# Altium project NANORACK_LASER_EXT.PrjPcb
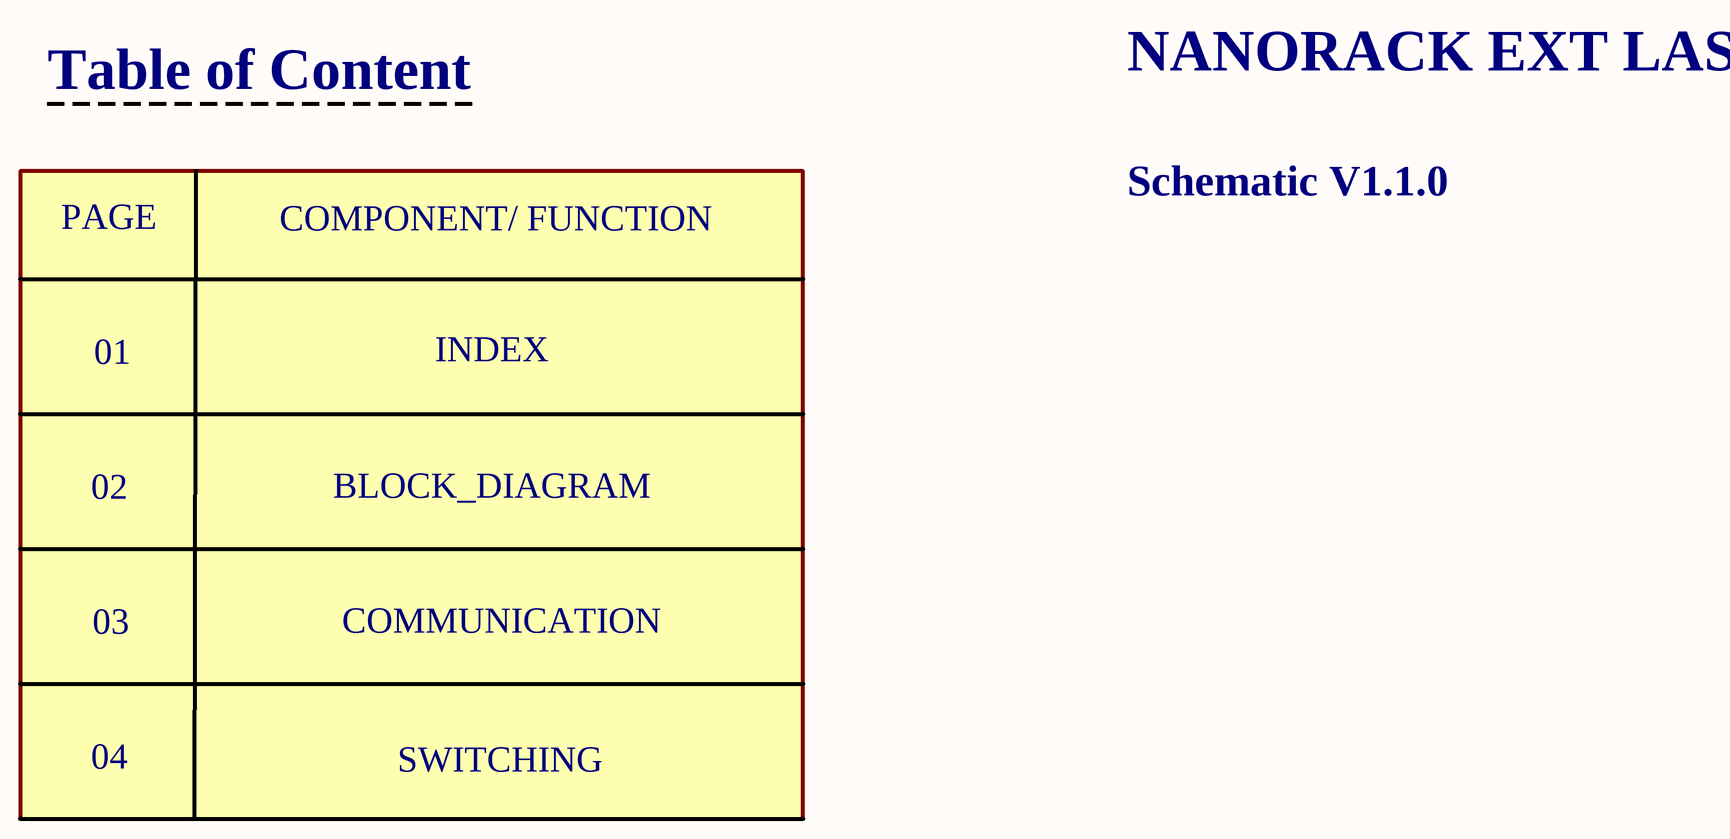
[diagram p0: INDEX.SchDoc]
4 sheets, 39 parts. Net scope: global (net labels, ports and power ports of the same name join across sheets).
Board file: LASER_EXT_V1.1.0.PcbDoc
Sheets:
  INDEX.SchDoc
  BLOCK_DIAGRAM.SchDoc
  COMMUNICATION.SchDoc
  SWITCHING.SchDoc

## Sheet INDEX.SchDoc
size 420 x 297 mm; Date: 21/02/2025; Address1: BEE-PC1; SheetNumber: 1; SheetTotal: 4

### Notes on the sheet
- NANORACK EXT LASER
- Table of Content
- COMPONENT/ FUNCTION
- Schematic V1.1.0
- PAGE
- INDEX
- 01
- BLOCK_DIAGRAM
- 02
- COMMUNICATION
- 03
- SWITCHING
- 04
- Project:
- Sub-system:
- Design by:
- SAMY VE
- BAO BUI Q.
- Sheet title:
- Sheet
- A3
- of
- Checked by:
- Approved by:
- VU PHAM
- Revision:
- Document No:
- V1.1.0
- Size:
- Date:

## Sheet BLOCK_DIAGRAM.SchDoc
size 420 x 297 mm; Date: 21/02/2025; Address1: BEE-PC1; SheetNumber: 2; SheetTotal: 4
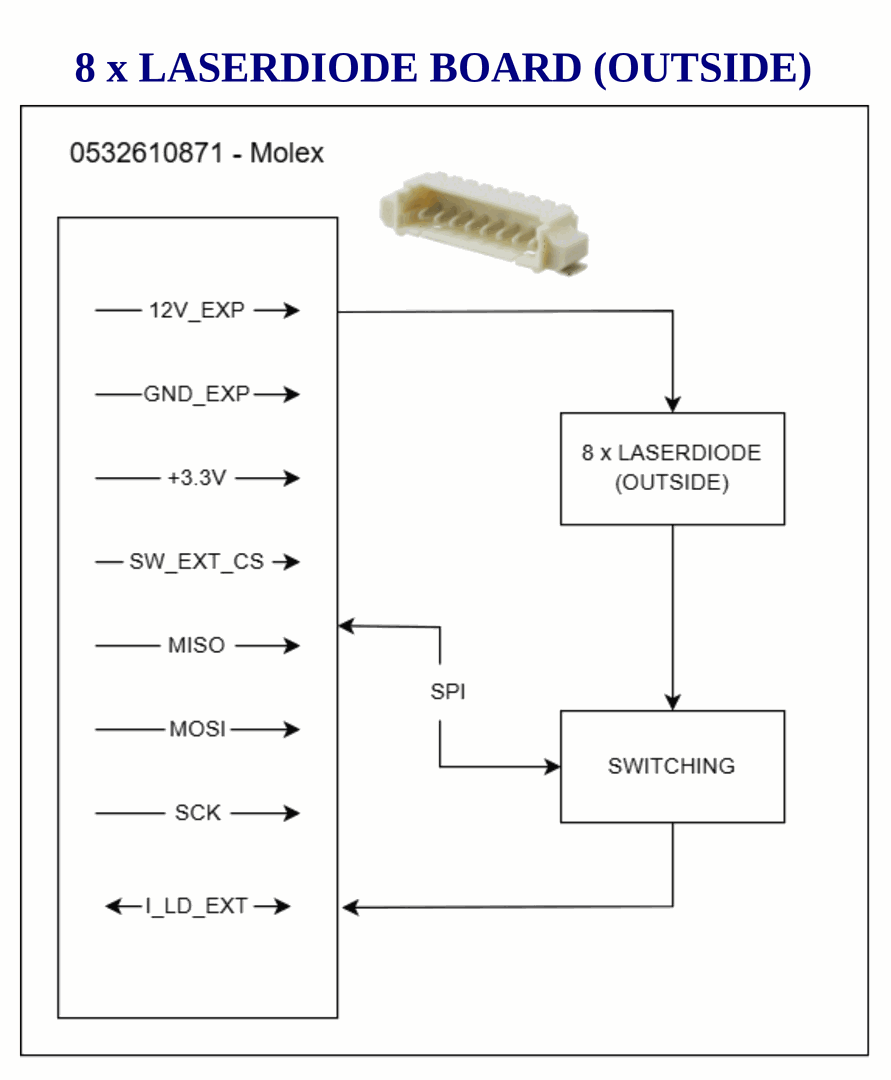
[diagram p1: BLOCK_DIAGRAM.SchDoc]

### Notes on the sheet
- 8 x LASERDIODE BOARD (OUTSIDE)
- Project:
- Sub-system:
- Design by:
- SAMY VE
- BAO BUI Q.
- Sheet title:
- Sheet
- A3
- of
- Checked by:
- Approved by:
- VU PHAM
- Revision:
- Document No:
- V1.1.0
- Size:
- Date:

## Sheet COMMUNICATION.SchDoc
size 420 x 297 mm; Date: 21/02/2025; Address1: BEE-PC1; SheetNumber: 3; SheetTotal: 4
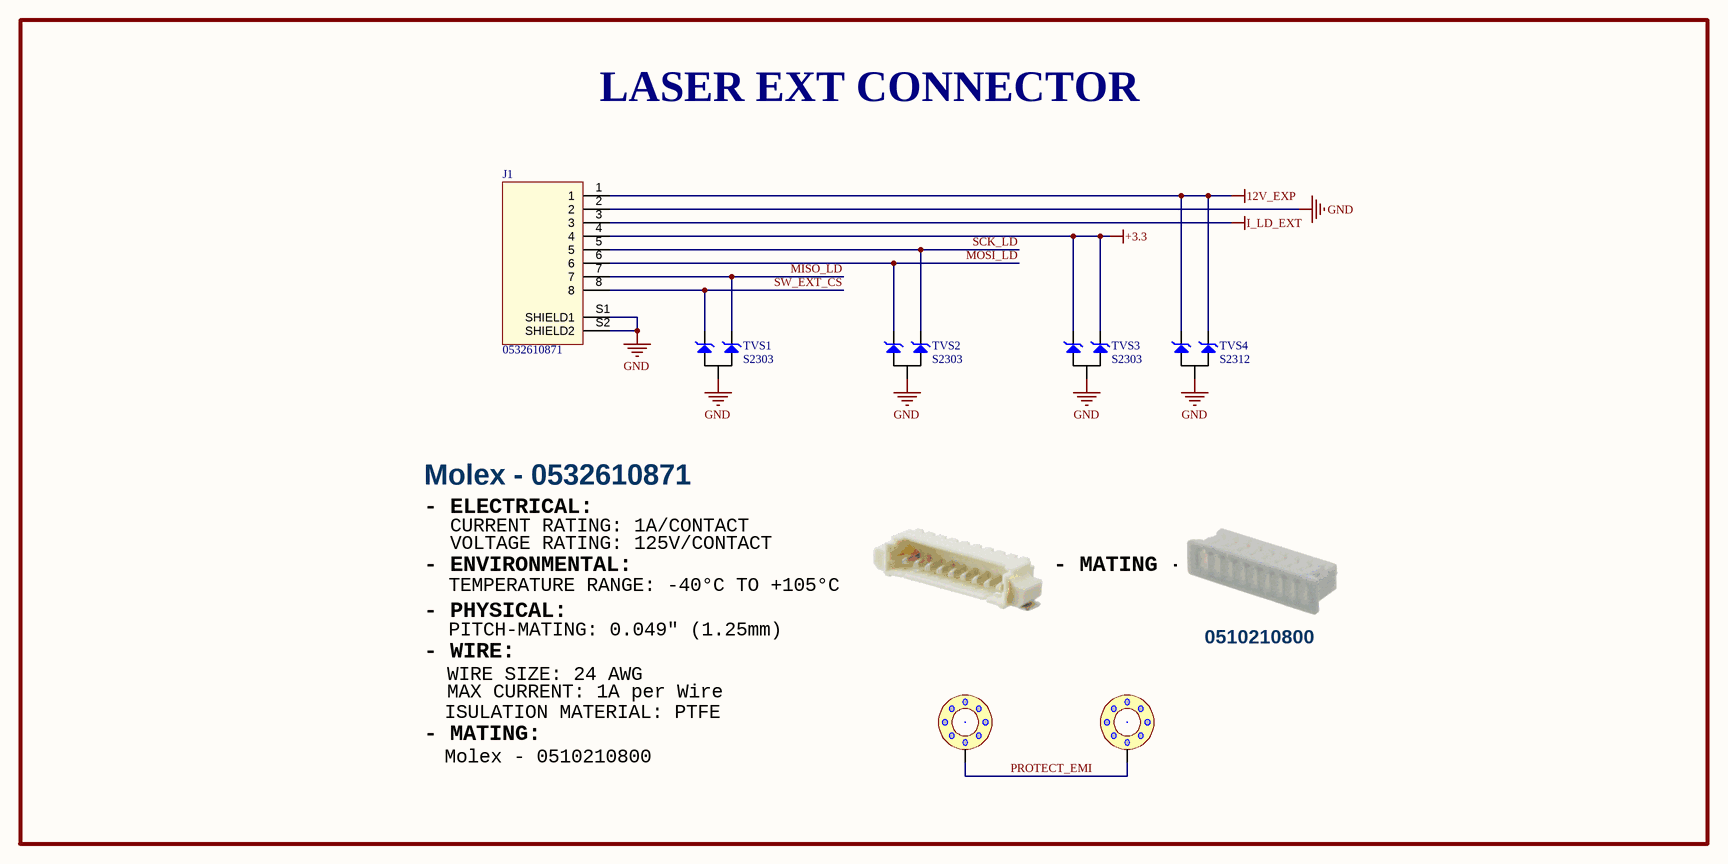
[diagram p2: COMMUNICATION.SchDoc]

### Parts
Hole1  Hole  [Hole space]  (value not drawn)
Hole2  Hole  [Hole space]  (value not drawn)
J1  0532610871  [0532610871]
TVS1  S2303  [SOT23-123]
TVS2  S2303  [SOT23-123]
TVS3  S2303  [SOT23-123]
TVS4  S2312  [SOT23-123]

### Nets
12V_EXP: J1.1 TVS4.1 TVS4.3
+3.3: J1.4 TVS3.1 TVS3.3
GND: J1.2 J1.S1(SHIELD1) J1.S2(SHIELD2) TVS1.2 TVS2.2 TVS3.2 TVS4.2
I_LD_EXT: J1.3
MISO_LD: J1.7 TVS1.1
MOSI_LD: J1.6 TVS2.3
PROTECT_EMI: Hole1.1 Hole2.1
SCK_LD: J1.5 TVS2.1
SW_EXT_CS: J1.8 TVS1.3

### Notes on the sheet
- LASER EXT CONNECTOR
- Molex - 0532610871
- - ELECTRICAL:
- CURRENT RATING: 1A/CONTACT
- VOLTAGE RATING: 125V/CONTACT
- - ENVIRONMENTAL:
- - PHYSICAL:
- TEMPERATURE RANGE: -40°C TO +105°C
- - MATING -
- - WIRE:
- WIRE SIZE: 24 AWG
- PITCH-MATING: 0.049" (1.25mm)
- 0510210800
- - MATING:
- ISULATION MATERIAL: PTFE
- Molex - 0510210800
- MAX CURRENT: 1A per Wire
- Project:
- Sub-system:
- Design by:
- SAMY VE
- BAO BUI Q.
- Sheet title:
- Sheet
- A3
- of
- Checked by:
- Approved by:
- VU PHAM
- Revision:
- Document No:
- V1.1.0
- Size:
- Date:

### Library data of the parts
J1 = Header8 - Shield: CONN HEADER SMD R/A 8POS 1.25MM
TVS1-TVS3 = S2303: TVS DIODE 3.3VWM 8VC SOT233
TVS4 = S2315: TVS DIODE 12VWM 19VC SOT233

## Sheet SWITCHING.SchDoc
size 420 x 297 mm; Date: 21/02/2025; Address1: BEE-PC1; SheetNumber: 4; SheetTotal: 4
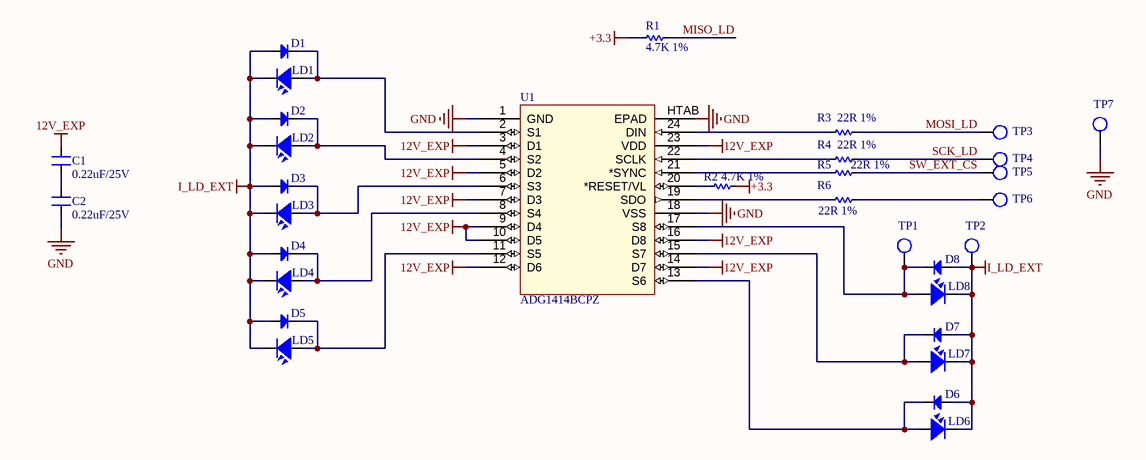
[diagram p3: SWITCHING.SchDoc]

### Parts
C1  0.22uF/25V  [CN-SMD-0603]
C2  0.22uF/25V  [CN-SMD-0603]
D1  1N4148W-TP  [SOD123]  (value not drawn)
D2  1N4148W-TP  [SOD123]  (value not drawn)
D3  1N4148W-TP  [SOD123]  (value not drawn)
D4  1N4148W-TP  [SOD123]  (value not drawn)
D5  1N4148W-TP  [SOD123]  (value not drawn)
D6  1N4148W-TP  [SOD123]  (value not drawn)
D7  1N4148W-TP  [SOD123]  (value not drawn)
D8  1N4148W-TP  [SOD123]  (value not drawn)
LD1  LaserDiode  [LASER_SOCKET]  (value not drawn)
LD2  LaserDiode  [LASER_SOCKET]  (value not drawn)
LD3  LaserDiode  [LASER_SOCKET]  (value not drawn)
LD4  LaserDiode  [LASER_SOCKET]  (value not drawn)
LD5  LaserDiode  [LASER_SOCKET]  (value not drawn)
LD6  LaserDiode  [LASER_SOCKET]  (value not drawn)
LD7  LaserDiode  [LASER_SOCKET]  (value not drawn)
LD8  LaserDiode  [LASER_SOCKET]  (value not drawn)
R1  4.7K 1%  [RES-SMD-0603]
R2  4.7K 1%  [RES-SMD-0603]
R3  22R 1%  [RES-SMD-0603]
R4  22R 1%  [RES-SMD-0603]
R5  22R 1%  [RES-SMD-0603]
R6  22R 1%  [RES-SMD-0603]
TP1  Test-Point  [TESTPOINT]  (value not drawn)
TP2  Test-Point  [TESTPOINT]  (value not drawn)
TP3  Test-Point  [TESTPOINT]  (value not drawn)
TP4  Test-Point  [TESTPOINT]  (value not drawn)
TP5  Test-Point  [TESTPOINT]  (value not drawn)
TP6  Test-Point  [TESTPOINT]  (value not drawn)
TP7  Test-Point  [TESTPOINT]  (value not drawn)
U1  ADG1414BCPZ  [ADG1414BCPZ]

### Nets
12V_EXP: C1.2 U1.3(D1) U1.5(D2) U1.7(D3) U1.9(D4) U1.10(D5) U1.12(D6) U1.14(D7) U1.16(D8) U1.23(VDD)
+3.3: R1.1 R2.1
GND: C2.1 TP7.1 U1.1(GND) U1.18(VSS) U1.HTAB(EPAD)
I_LD_EXT: D1.1(A) D2.1(A) D3.1(A) D4.1(A) D5.1(A) D6.1(A) D7.1(A) D8.1(A) LD1.3 LD2.3 LD3.3 LD4.3 LD5.3 LD6.3 LD7.3 LD8.3 TP2.1
MISO_LD: R1.2
MOSI_LD: R3.1 TP3.1
SCK_LD: R4.1 TP4.1
SW_EXT_CS: R5.1 TP5.1
NetC1_1: C1.1 C2.2
NetD1_2: D1.2(K) LD1.1 U1.2(S1)
NetD2_2: D2.2(K) LD2.1 U1.4(S2)
NetD3_2: D3.2(K) LD3.1 U1.6(S3)
NetD4_2: D4.2(K) LD4.1 U1.8(S4)
NetD5_2: D5.2(K) LD5.1 U1.11(S5)
NetD6_2: D6.2(K) LD6.1 U1.13(S6)
NetD7_2: D7.2(K) LD7.1 U1.15(S7)
NetD8_2: D8.2(K) LD8.1 TP1.1 U1.17(S8)
NetR2_2: R2.2 U1.20(*RESET/VL)
NetR3_2: R3.2 U1.24(DIN)
NetR4_2: R4.2 U1.22(SCLK)
NetR5_2: R5.2 U1.21(*SYNC)
NetR6_1: R6.1 TP6.1
NetR6_2: R6.2 U1.19(SDO)

### Notes on the sheet
- Project:
- Sub-system:
- Design by:
- SAMY VE
- BAO BUI Q.
- Sheet title:
- Sheet
- A3
- of
- Checked by:
- Approved by:
- VU PHAM
- Revision:
- Document No:
- V1.1.0
- Size:
- Date:

### Library data of the parts
C1 C2 = CN: CAP CER 0.22UF 25V X7R 0603; Value: 33pF
D1-D8 = Diode SMD: DIODE STANDARD 100V 150MA SOD123; Code - JEDEC: DO-214-AB; Value: 1N5007; Published: 8-Jun-2000; Revision: July-2002: Re-released for DXP Platform.; Publisher: Altium Limited
LD1-LD8 = LASER
R1 R2 = Res-SMD: RES SMD 4.7K OHM 1% 1/10W 0603; Manufacturer: Generic Components; Class: Passive; Published: 08/06/2000; Publisher: Altium Hobart Technology Centre
R3-R6 = Res-SMD: Resistor; Manufacturer: Generic Components; Class: Passive; Published: 08/06/2000; Publisher: Altium Hobart Technology Centre
U1 = ADG1414BCPZ: IC SW SPST-NOX8 11.5OHM 24LFCSP

## Nets that join several sheets
12V_EXP: COMMUNICATION (J1.1 TVS4.1 TVS4.3), SWITCHING (10 pins)
+3.3: COMMUNICATION (J1.4 TVS3.1 TVS3.3), SWITCHING (R1.1 R2.1)
GND: COMMUNICATION (7 pins), SWITCHING (5 pins)
I_LD_EXT: COMMUNICATION (J1.3), SWITCHING (17 pins)
MISO_LD: COMMUNICATION (J1.7 TVS1.1), SWITCHING (R1.2)
MOSI_LD: COMMUNICATION (J1.6 TVS2.3), SWITCHING (R3.1 TP3.1)
SCK_LD: COMMUNICATION (J1.5 TVS2.1), SWITCHING (R4.1 TP4.1)
SW_EXT_CS: COMMUNICATION (J1.8 TVS1.3), SWITCHING (R5.1 TP5.1)